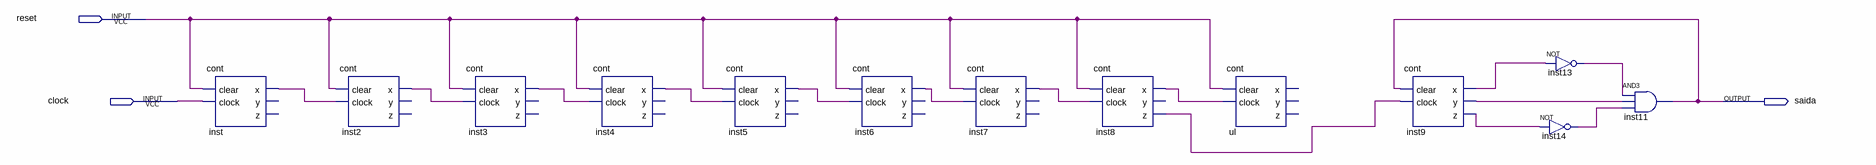
[diagram p0: schematic sheet]
// Quartus schematic temporizador.bdf as structural Verilog: 13 symbols, 3 pins
module temporizador (
  input  reset,
  input  clock,
  output saida
);

  wire inst2_x, inst3_x, inst4_x, inst5_x, inst6_x, inst7_x, inst8_x, inst8_z, inst9_x, inst9_y, inst9_z,
       inst13_out, inst14_out, inst_x;

  cont inst (.clear(reset), .clock(clock), .x(inst_x));  // open: y, z
  cont inst2 (.clear(reset), .clock(inst_x), .x(inst2_x));  // open: y, z
  cont inst3 (.clear(reset), .clock(inst2_x), .x(inst3_x));  // open: y, z
  cont inst4 (.clear(reset), .clock(inst3_x), .x(inst4_x));  // open: y, z
  cont inst5 (.clear(reset), .clock(inst4_x), .x(inst5_x));  // open: y, z
  cont inst6 (.clear(reset), .clock(inst5_x), .x(inst6_x));  // open: y, z
  cont inst7 (.clear(reset), .clock(inst6_x), .x(inst7_x));  // open: y, z
  cont inst8 (.clear(reset), .clock(inst7_x), .x(inst8_x), .z(inst8_z));  // open: y
  cont ul (.clear(reset), .clock(inst8_x));  // open: x, y, z
  cont inst9 (.clear(saida), .clock(inst8_z), .x(inst9_x), .y(inst9_y), .z(inst9_z));
  not inst13 (inst13_out, inst9_x);
  not inst14 (inst14_out, inst9_z);
  and inst11 (saida, inst13_out, inst9_y, inst14_out);
endmodule
